# Altium schematic sheet Hex_Link_Rec.SchDoc
size A4
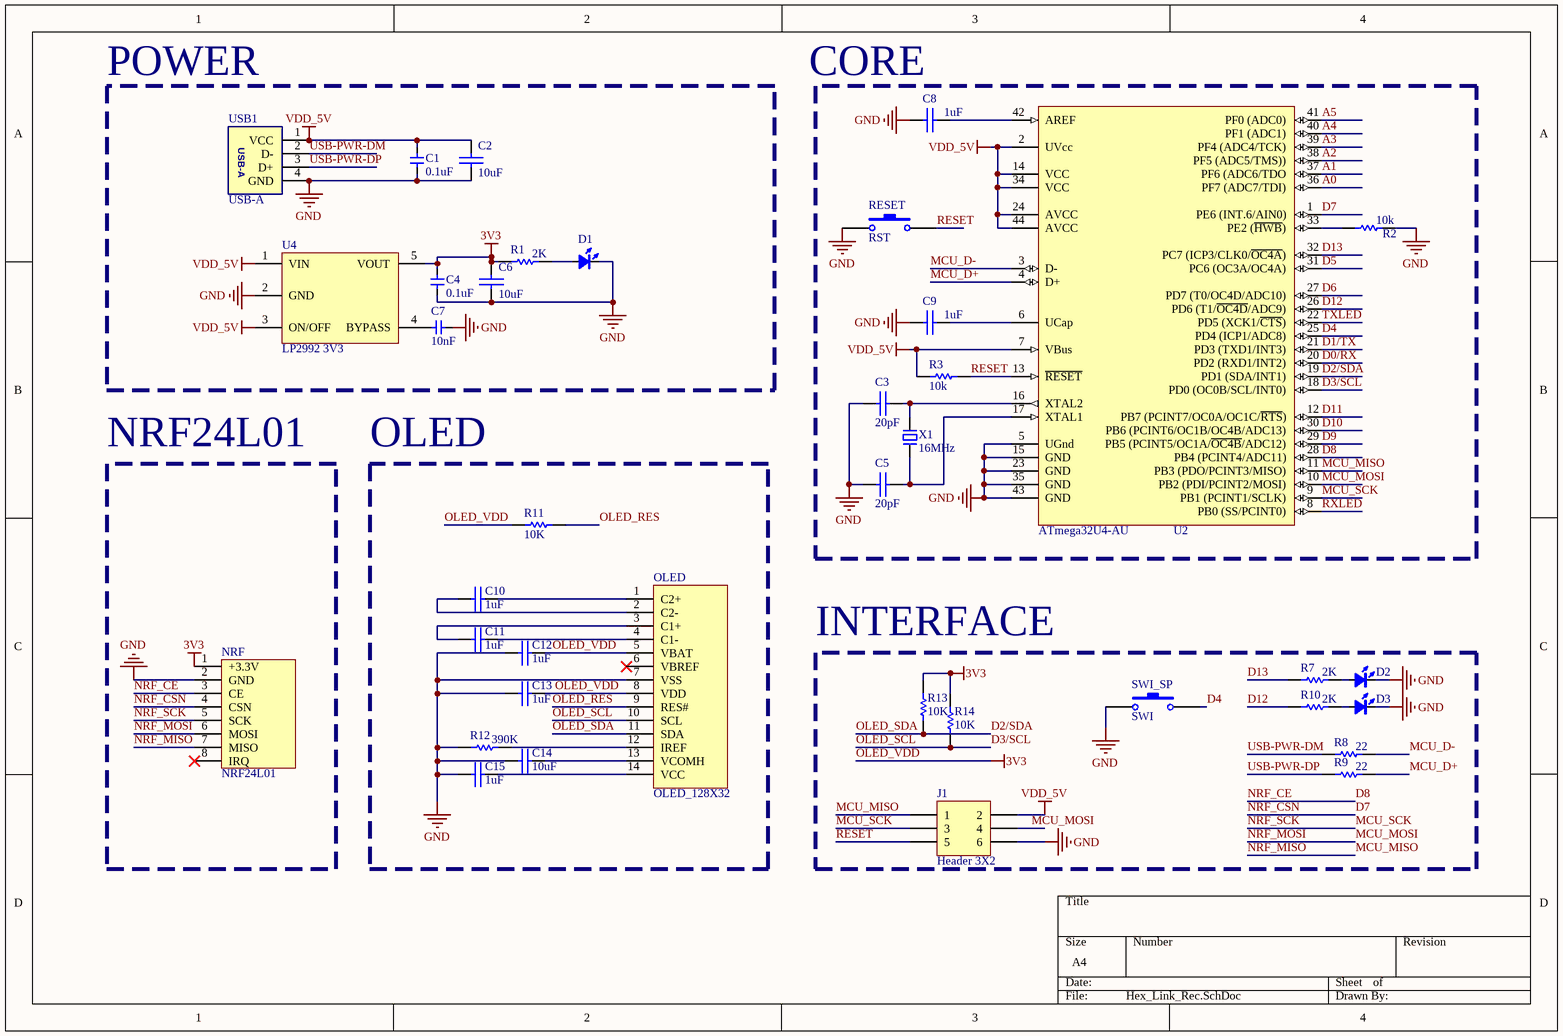
[diagram p0: Hex_Link_Rec.SchDoc]

## Parts
C1  0.1uF  [CAP_0402]
C2  10uF  [CAP_0402]
C3  20pF  [CAP_0402]
C4  0.1uF  [CAP_0402]
C5  20pF  [CAP_0402]
C6  10uF  [CAP_0402]
C7  10nF  [CAP_0402]
C8  1uF  [CAP_0402]
C9  1uF  [CAP_0402]
C10  1uF  [CAP_0402]
C11  1uF  [CAP_0402]
C12  1uF  [CAP_0402]
C13  1uF  [CAP_0402]
C14  10uF  [CAP_0402]
C15  1uF  [CAP_0402]
D1  color?  [LED_0402_RED]  (value not drawn)
D2  color?  [LED_0402_RED]  (value not drawn)
D3  color?  [LED_0402_RED]  (value not drawn)
J1  Header 3X2  [HDR2X3]
NRF  NRF24L01  [NRF24l01-SMD]
OLED  OLED_128X32  [OLED_128X32]
R1  2K  [RES_0402]
R2  10k  [RES_0402]
R3  10k  [RES_0402]
R7  2K  [RES_0402]
R8  22  [RES_0402]
R9  22  [RES_0402]
R10  2K  [RES_0402]
R11  10K  [RES_0402]
R12  390K  [RES_0402]
R13  10K  [RES_0402]
R14  10K  [RES_0402]
RESET  RST  [SW_PB]
SWI_SP  SWI  [SW_PB]
U2  ATmega32U4-AU  [44ML_N]
U4  LP2992 3V3  [SOT23-5]
USB1  USB-A  [USB_A/P_B]
X1  16MHz  [OSC 5032-2P]

## Blocks framed on the sheet
POWER: C1 C2 C4 C6 C7 D1 R1 U4 USB1
NRF24L01: NRF
OLED: C10-C15 OLED R11 R12
INTERFACE: D2 D3 J1 R7-R10 R13 R14 SWI_SP

## Nets
GND: C1.2 C2.2 C3.2 C4.2 C5.2 C6.2 C7.1 C8.2 C9.2 C12.2 C13.2 C14.2 C15.2 D1.2(K) D2.2(K) D3.2(K) J1.6 NRF.2(GND) OLED.7(VSS) R2.2 R12.1 RESET.1 SWI_SP.1 U2.5(UGnd) U2.15(GND) U2.23(GND) U2.35(GND) U2.43(GND) U4.2(GND) USB1.4(GND)
OLED_VDD: C4.1 C6.1 C12.1 C13.1 NRF.1(+3.3V) OLED.5(VBAT) OLED.8(VDD) R1.1 R11.1 R13.2 R14.2 U4.5(VOUT)  [also labelled 3V3]
VDD_5V: C1.1 C2.1 J1.2 R3.2 U2.2(UVcc) U2.7(VBus) U2.14(VCC) U2.24(AVCC) U2.34(VCC) U2.44(AVCC) U4.1(VIN) U4.3(ON/OFF) USB1.1(VCC)
A0: U2.36(PF7_(ADC7/TDI))
A1: U2.37(PF6_(ADC6/TDO)
A2: U2.38(PF5_(ADC5/TMS)))
A3: U2.39(PF4_(ADC4/TCK))
A4: U2.40(PF1_(ADC1))
A5: U2.41(PF0_(ADC0))
D0/RX: U2.20(PD2_(RXD1/INT2))
D1/TX: U2.21(PD3_(TXD1/INT3))
D2/SDA: OLED.11(SDA) R13.1 U2.19(PD1_(SDA/INT1))  [also labelled OLED_SDA]
D3/SCL: OLED.10(SCL) R14.1 U2.18(PD0_(OC0B/SCL/INT0))  [also labelled OLED_SCL]
D4: SWI_SP.2 U2.25(PD4_(ICP1/ADC8))
D5: U2.31(PC6_(OC3A/OC4A))
D6: U2.27(PD7_(T0/OC4D/ADC10))
D7: NRF.4(CSN) U2.1(PE6_(INT.6/AIN0))  [also labelled NRF_CSN]
D8: NRF.3(CE) U2.28(PB4_(PCINT4/ADC11))  [also labelled NRF_CE]
D9: U2.29(PB5_(PCINT5/OC1A/~{OC4B}/ADC12))
D10: U2.30(PB6_(PCINT6/OC1B/OC4B/ADC13))
D11: U2.12(PB7_(PCINT7/OC0A/OC1C/~{RTS}))
D12: R10.1 U2.26(PD6_(T1/~{OC4D}/ADC9))
D13: R7.1 U2.32(PC7_(ICP3/CLK0/~{OC4A}))
MCU_D+: R9.2 U2.4(D+)
MCU_D-: R8.2 U2.3(D-)
MCU_MISO: J1.1 NRF.7(MISO) U2.11(PB3_(PDO/PCINT3/MISO))  [also labelled NRF_MISO]
MCU_MOSI: J1.4 NRF.6(MOSI) U2.10(PB2_(PDI/PCINT2/MOSI))  [also labelled NRF_MOSI]
MCU_SCK: J1.3 NRF.5(SCK) U2.9(PB1_(PCINT1/SCLK))  [also labelled NRF_SCK]
OLED_RES: OLED.9(RES#) R11.2
RESET: J1.5 R3.1 RESET.2 U2.13(~{RESET})
RXLED: U2.8(PB0_(SS/PCINT0))
TXLED: U2.22(PD5_(XCK1/~{CTS}))
USB-PWR-DM: R8.1 USB1.2(D-)
USB-PWR-DP: R9.1 USB1.3(D+)
NetC3_1: C3.1 U2.16(XTAL2) X1.2
NetC5_1: C5.1 U2.17(XTAL1) X1.1
NetC7_2: C7.2 U4.4(BYPASS)
NetC8_1: C8.1 U2.42(AREF)
NetC9_1: C9.1 U2.6(UCap)
NetC10_1: C10.1 OLED.1(C2+)
NetC10_2: C10.2 OLED.2(C2-)
NetC11_1: C11.1 OLED.4(C1-)
NetC11_2: C11.2 OLED.3(C1+)
NetC14_1: C14.1 OLED.13(VCOMH)
NetC15_1: C15.1 OLED.14(VCC)
NetD1_1: D1.1(A) R1.2
NetD2_1: D2.1(A) R7.2
NetD3_1: D3.1(A) R10.2
NetOLED_12: OLED.12(IREF) R12.2
NetR2_1: R2.1 U2.33(PE2_(~{HWB}))

Not connected (* = marked no-connect by the designer): NRF 8(IRQ)*; OLED 6(VBREF)*

## Notes on the sheet
- (near C8) CORE

## Library data of the parts
C1 C4 C7 = 电容-0402: Capacitor; Value: 0.1u
C2 C3 C5 C6 C8-C15 = CAP: 无极性电容
D1-D3 = LED_0402: LED; Type: 0402; Value: color?
J1 = Header 3X2: Header, 3-Pin, Dual row; LatestRevisionDate: 17-Jul-2002; LatestRevisionNote: Re-released for DXP Platform.; Publisher: Altium Limited
R1-R3 R7-R14 = RES
RESET SWI_SP = SW-PB: Switch; Published: 24-Mar-1999; LatestRevisionDate: 17-Jul-2002; LatestRevisionNote: Re-released for DXP Platform.; PackageReference: SPST-2; Publisher: Altium Limited; PackageDescription: Switch; 2 Leads
U2 = ATmega32U4-AU: 8-bit AVR Microcontroller, 2.7-5.5V, 32KB Flash, 2.5KB EEPROM, 1KB SRAM, USB Controller, 44-pin TQFP, Industrial Grade (-40癈 to 85癈); Published: 1-Apr-2010; DatasheetVersion: revD, Jan-2009; PackageVersion: rev.G, Jul-2007; PackageReference: 44ML; Publisher: Altium Limited; PackageDescription: 44-Pin Plastic Thin Quad Flat Pack, 10 x 10 x 1.0 mm Body, 0.8 mm Pitch (TQFP); Supplier 1: Digi-Key; Supplier Part Number 1: ATMEGA32U4-AU-ND; Supplier 2: Farnell; Supplier Part Number 2: 1748525; Supplier 3: Mouser; Supplier Part Number 3: 556-ATMEGA32U4-AU; ComponentLink1Description: Manufacturer Link; ComponentLink1URL: http://www.atmel.com/products/avr/default.asp?; ComponentLink2Description: ATmega16U4/32U4 Datasheet; ComponentLink2URL: http://www.atmel.com/dyn/resources/prod_documents/doc7766.pdf; ComponentLink3Description: ATmega16U4 ATmega32U4 Summary; ComponentLink3URL: http://www.atmel.com/dyn/resources/prod_documents/7766S.pdf; ComponentLink4Description: Atmel.com Home; ComponentLink4URL: http://www.atmel.com
U4 = LP2992: LDO
X1 = XTAL-2P: 2脚无源脚晶振